# Altium schematic sheet Master MicroController Port H.SchDoc: Master Micro Controller Port H Pin Out
size A4; DocumentNumber: 23; SheetNumber: 23; SheetTotal: 54
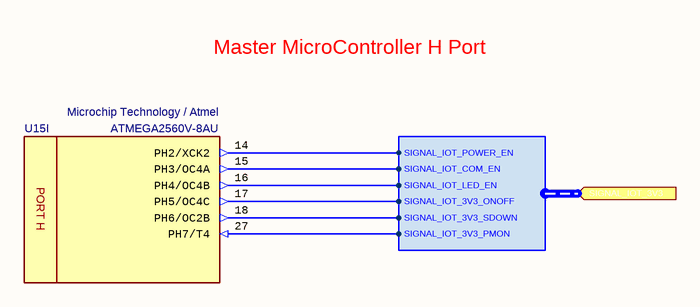
[diagram p0: Master MicroController Port H.SchDoc]

## Parts
U15  Manufacturer Part Number: ATMEGA2560V-8AU  Manufacturer Name: Microchip Technology / Atmel  [TQFP100]  (hidden comment: 8-bit MicroController)  (part I of 15)

## Ports
SIGNAL_IOT_3V3 (in, harness SIGNAL_IOT_3V3)

## Harnesses
SIGNAL_IOT_3V3: SIGNAL_IOT_COM_EN, SIGNAL_IOT_POWER_EN, SIGNAL_IOT_LED_EN, SIGNAL_IOT_3V3_SDOWN, SIGNAL_IOT_3V3_ONOFF, SIGNAL_IOT_3V3_PMON

## Nets
NetU15_14: U15.14(PH2/XCK2) ; port SIGNAL_IOT_3V3.SIGNAL_IOT_POWER_EN
NetU15_15: U15.15(PH3/OC4A) ; port SIGNAL_IOT_3V3.SIGNAL_IOT_COM_EN
NetU15_16: U15.16(PH4/OC4B) ; port SIGNAL_IOT_3V3.SIGNAL_IOT_LED_EN
NetU15_17: U15.17(PH5/OC4C) ; port SIGNAL_IOT_3V3.SIGNAL_IOT_3V3_ONOFF
NetU15_18: U15.18(PH6/OC2B) ; port SIGNAL_IOT_3V3.SIGNAL_IOT_3V3_SDOWN
NetU15_27: U15.27(PH7/T4) ; port SIGNAL_IOT_3V3.SIGNAL_IOT_3V3_PMON

## Notes on the sheet
- Master MicroController H Port
- Engineer
- All Rights are reserved to Customer and Engineer. [2021]
- Size:
- Date:
- A4
- Project :
- Time:
- Sheet
- of
- Customer
- Product ID
- Module ID
- Version
- File:
- Revision
- (in symbol IC - ATMEGA2560V-8AU, part I) PORT H

## Library data of the parts
U15 = IC - ATMEGA2560V-8AU: 8-bit Microcontrollers - MCU 256kB Flash 4kB EEPROM 86 I/O Pins; Supply Voltage - Min: 2V7; Supply Voltage - Max: 5.5V; Height: 1mm; ComponentLink1Description: DataSheet; ComponentLink1URL: https://eu.mouser.com/datasheet/2/268/Atmel-2549-8-bit-AVR-Microcontroller-ATmega640-128-1315286.pdf; ROHS: Yes; Minimum Operating Temperature: -40; Maximum Operating Temperature: +85; ComponentLink2Description: Mouser; ComponentLink2URL: https://eu.mouser.com/ProductDetail/Microchip-Technology-Atmel/ATMEGA2560V-8AU?qs=sGAEpiMZZMutXGli8Ay4kKlCYcvZUWqJYdtgGFyqFT8%3D; Supplier 1: Digi-Key; Supplier 2: Newark; Supplier 3: Avnet; Supplier 4: RSComponents; Supplier 5: RSComponents; Supplier Part Number 1: ATMEGA2560V-8AU-ND; Supplier Part Number 2: 68T2784; Supplier Part Number 3: 68T2784; Supplier Part Number 4: 1278284P; Supplier Part Number 5: 1278284; Case: TQFP-100; Supplier 6: Mouser; Supplier 7: Future Electronics; Supplier 8: Avnet; Supplier 9: Arrow Electronics; Supplier 10: Farnell; Supplier 11: Allied Electronics; Supplier 12: Future Electronics; Supplier 13: RSComponents; Supplier 14: RSComponents; Supplier 15: RSComponents; Supplier Part Number 6: 556-ATMEGA2560V8AU; Supplier Part Number 7: 4038198; Supplier Part Number 8: ATMEGA2560V-8AU; Supplier Part Number 9: ATMEGA2560V-8AU; Supplier Part Number 10: 1288331; Supplier Part Number 11: 70124009; Supplier Part Number 12: ATMEGA2560V-8AU-TRAY; Supplier Part Number 13: 6963424; Supplier Part Number 14: 6963424P; Supplier Part Number 15: 9220809